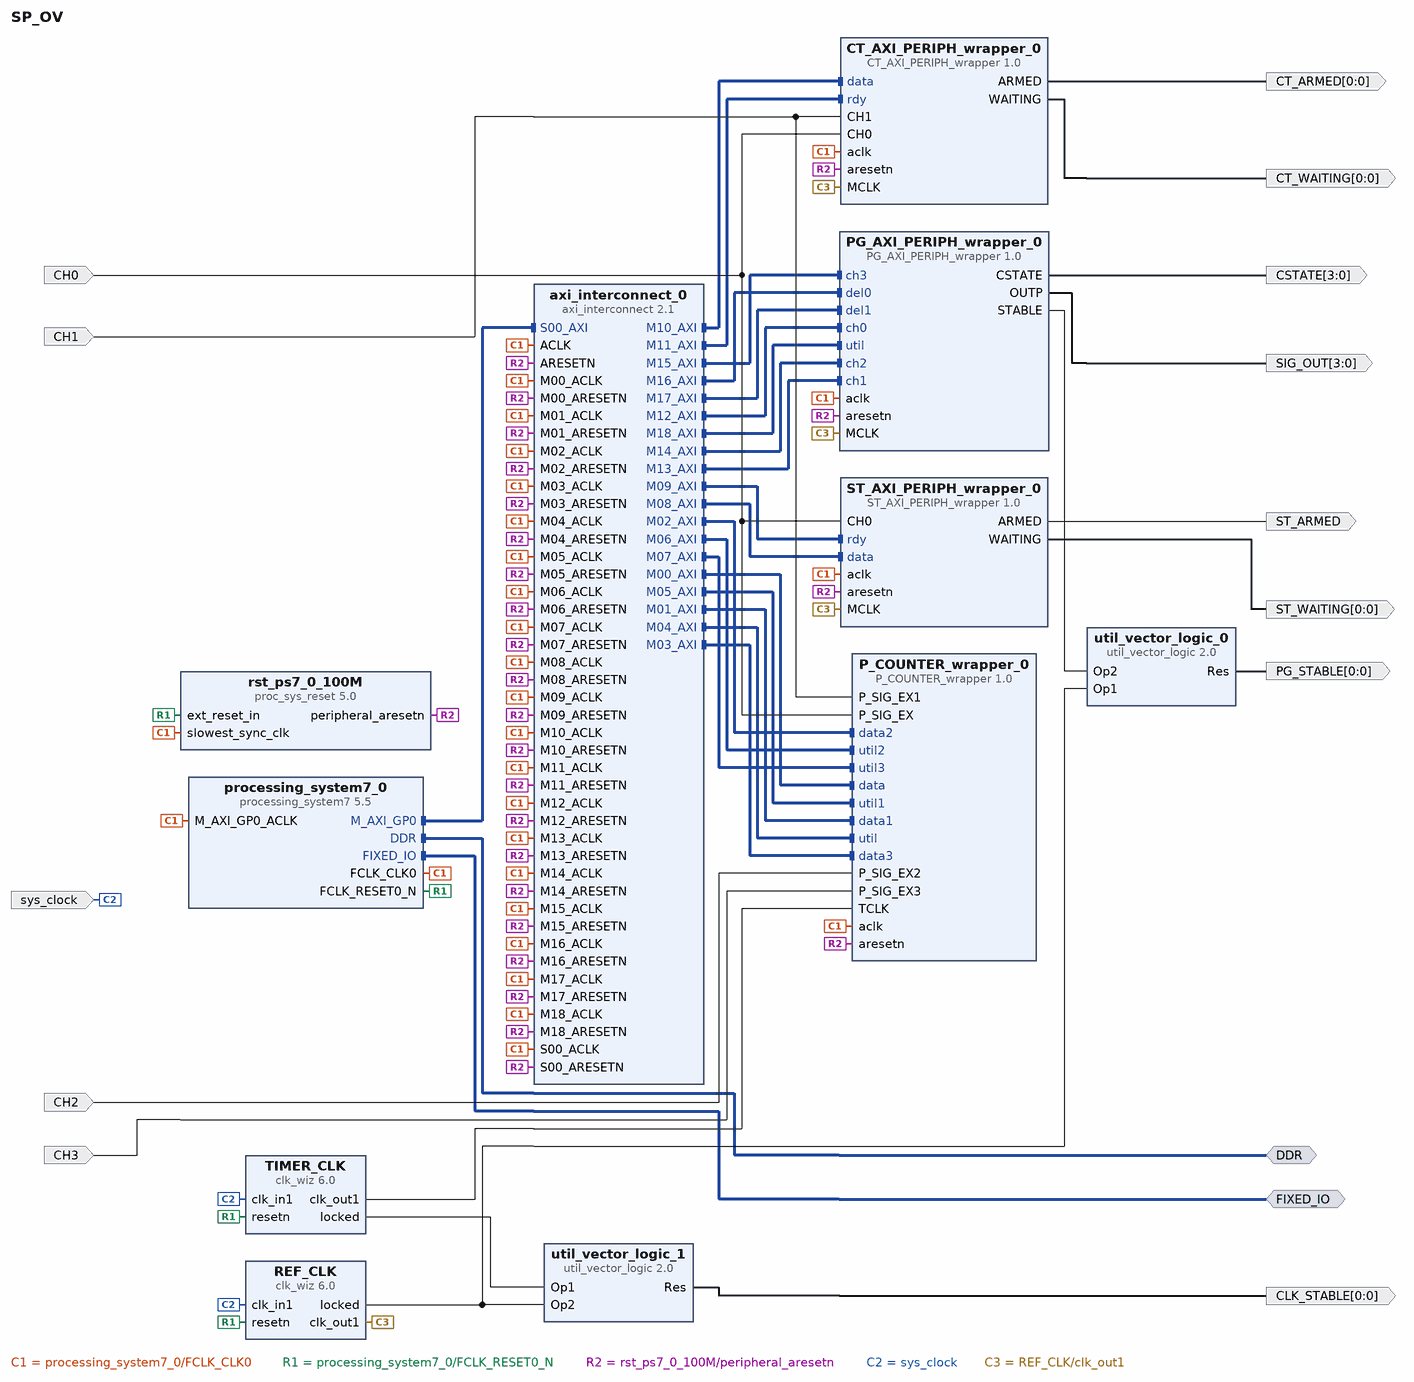
[diagram p0: block diagram of the top level]
# Vivado block design SP_OV, xc7z020clg400-1, Vivado 2019.1
create_bd_design SP_OV

create_bd_intf_port -mode Master -vlnv xilinx.com:interface:ddrx_rtl:1.0 DDR
create_bd_intf_port -mode Master -vlnv xilinx.com:display_processing_system7:fixedio_rtl:1.0 FIXED_IO
create_bd_port -dir I -type clk sys_clock
set_property -dict {CONFIG.FREQ_HZ 125000000 CONFIG.PHASE 0.000} [get_bd_ports sys_clock]
create_bd_port -dir I CH0
create_bd_port -dir I CH1
create_bd_port -dir I CH2
create_bd_port -dir I CH3
create_bd_port -dir O -from 3 -to 0 SIG_OUT
create_bd_port -dir O -from 3 -to 0 CSTATE
create_bd_port -dir O ST_ARMED
create_bd_port -dir O -from 0 -to 0 ST_WAITING
create_bd_port -dir O -from 0 -to 0 CT_ARMED
create_bd_port -dir O -from 0 -to 0 CT_WAITING
create_bd_port -dir O -from 0 -to 0 PG_STABLE
create_bd_port -dir O -from 0 -to 0 CLK_STABLE

create_bd_cell -type ip -vlnv xilinx.com:ip:axi_interconnect:2.1 axi_interconnect_0
set_property -dict {CONFIG.NUM_MI 19} [get_bd_cells axi_interconnect_0]
create_bd_cell -type ip -vlnv xilinx.com:ip:util_vector_logic:2.0 util_vector_logic_0
set_property -dict {CONFIG.C_SIZE 1} [get_bd_cells util_vector_logic_0]
create_bd_cell -type ip -vlnv xilinx.com:ip:util_vector_logic:2.0 util_vector_logic_1
set_property -dict {CONFIG.C_SIZE 1} [get_bd_cells util_vector_logic_1]
create_bd_cell -type ip -vlnv cri.nz:user:CT_AXI_PERIPH_wrapper:1.0 CT_AXI_PERIPH_wrapper_0
create_bd_cell -type ip -vlnv cri.nz:user:P_COUNTER_wrapper:1.0 P_COUNTER_wrapper_0
create_bd_cell -type ip -vlnv cri.nz:user:ST_AXI_PERIPH_wrapper:1.0 ST_AXI_PERIPH_wrapper_0
create_bd_cell -type ip -vlnv xilinx.com:ip:clk_wiz:6.0 REF_CLK
set_property -dict [list \
  CONFIG.CLKIN1_JITTER_PS 80.0 \
  CONFIG.CLKOUT1_JITTER 168.588 \
  CONFIG.CLKOUT1_PHASE_ERROR 234.038 \
  CONFIG.CLKOUT1_REQUESTED_OUT_FREQ 450.000 \
  CONFIG.CLK_IN1_BOARD_INTERFACE sys_clock \
  CONFIG.MMCM_CLKFBOUT_MULT_F 40.500 \
  CONFIG.MMCM_CLKIN1_PERIOD 8.000 \
  CONFIG.MMCM_CLKOUT0_DIVIDE_F 2.250 \
  CONFIG.MMCM_DIVCLK_DIVIDE 5 \
  CONFIG.RESET_PORT resetn \
  CONFIG.RESET_TYPE ACTIVE_LOW \
  CONFIG.USE_BOARD_FLOW true \
] [get_bd_cells REF_CLK]
create_bd_cell -type ip -vlnv xilinx.com:ip:clk_wiz:6.0 TIMER_CLK
set_property -dict [list \
  CONFIG.CLKIN1_JITTER_PS 80.0 \
  CONFIG.CLKOUT1_JITTER 119.348 \
  CONFIG.CLKOUT1_PHASE_ERROR 96.948 \
  CONFIG.CLKOUT1_REQUESTED_OUT_FREQ 125.000 \
  CONFIG.CLK_IN1_BOARD_INTERFACE sys_clock \
  CONFIG.MMCM_CLKFBOUT_MULT_F 8.000 \
  CONFIG.MMCM_CLKIN1_PERIOD 8.000 \
  CONFIG.MMCM_CLKOUT0_DIVIDE_F 8.000 \
  CONFIG.RESET_PORT resetn \
  CONFIG.RESET_TYPE ACTIVE_LOW \
  CONFIG.USE_BOARD_FLOW true \
] [get_bd_cells TIMER_CLK]
create_bd_cell -type ip -vlnv xilinx.com:ip:processing_system7:5.5 processing_system7_0
set_property -dict [list \
  CONFIG.PCW_APU_PERIPHERAL_FREQMHZ 650 \
  CONFIG.PCW_CRYSTAL_PERIPHERAL_FREQMHZ 50 \
  CONFIG.PCW_ENET0_ENET0_IO {MIO 16 .. 27} \
  CONFIG.PCW_ENET0_GRP_MDIO_ENABLE 1 \
  CONFIG.PCW_ENET0_GRP_MDIO_IO {MIO 52 .. 53} \
  CONFIG.PCW_ENET0_PERIPHERAL_ENABLE 1 \
  CONFIG.PCW_ENET0_RESET_ENABLE 1 \
  CONFIG.PCW_ENET0_RESET_IO {MIO 9} \
  CONFIG.PCW_ENET_RESET_ENABLE 1 \
  CONFIG.PCW_ENET_RESET_SELECT {Share reset pin} \
  CONFIG.PCW_FPGA0_PERIPHERAL_FREQMHZ 100 \
  CONFIG.PCW_FPGA1_PERIPHERAL_FREQMHZ 50 \
  CONFIG.PCW_GPIO_MIO_GPIO_ENABLE 1 \
  CONFIG.PCW_GPIO_MIO_GPIO_IO MIO \
  CONFIG.PCW_I2C_RESET_ENABLE 1 \
  CONFIG.PCW_M_AXI_GP0_FREQMHZ 10 \
  CONFIG.PCW_PERIPHERAL_BOARD_PRESET None \
  CONFIG.PCW_PRESET_BANK1_VOLTAGE {LVCMOS 1.8V} \
  CONFIG.PCW_QSPI_GRP_FBCLK_ENABLE 1 \
  CONFIG.PCW_QSPI_GRP_FBCLK_IO {MIO 8} \
  CONFIG.PCW_QSPI_GRP_SINGLE_SS_ENABLE 1 \
  CONFIG.PCW_QSPI_GRP_SINGLE_SS_IO {MIO 1 .. 6} \
  CONFIG.PCW_QSPI_PERIPHERAL_ENABLE 1 \
  CONFIG.PCW_QSPI_QSPI_IO {MIO 1 .. 6} \
  CONFIG.PCW_SD0_GRP_CD_ENABLE 1 \
  CONFIG.PCW_SD0_GRP_CD_IO {MIO 47} \
  CONFIG.PCW_SD0_GRP_WP_ENABLE 0 \
  CONFIG.PCW_SD0_PERIPHERAL_ENABLE 1 \
  CONFIG.PCW_SD0_SD0_IO {MIO 40 .. 45} \
  CONFIG.PCW_SDIO_PERIPHERAL_FREQMHZ 50 \
  CONFIG.PCW_SINGLE_QSPI_DATA_MODE x4 \
  CONFIG.PCW_UART0_PERIPHERAL_ENABLE 1 \
  CONFIG.PCW_UART0_UART0_IO {MIO 14 .. 15} \
  CONFIG.PCW_UART1_PERIPHERAL_ENABLE 0 \
  CONFIG.PCW_UART_PERIPHERAL_FREQMHZ 100 \
  CONFIG.PCW_UIPARAM_DDR_BUS_WIDTH {16 Bit} \
  CONFIG.PCW_UIPARAM_DDR_FREQ_MHZ 525 \
  CONFIG.PCW_UIPARAM_DDR_PARTNO {MT41J256M16 RE-125} \
  CONFIG.PCW_USB0_PERIPHERAL_ENABLE 1 \
  CONFIG.PCW_USB0_RESET_ENABLE 1 \
  CONFIG.PCW_USB0_RESET_IO {MIO 46} \
  CONFIG.PCW_USB0_USB0_IO {MIO 28 .. 39} \
  CONFIG.PCW_USB_RESET_ENABLE 1 \
  CONFIG.PCW_USB_RESET_SELECT {Share reset pin} \
] [get_bd_cells processing_system7_0]
# 497 more settings of processing_system7_0 are not shown: defaults, MIO pin electricals, DDR timing, and values the tool derives
create_bd_cell -type ip -vlnv xilinx.com:ip:proc_sys_reset:5.0 rst_ps7_0_100M
create_bd_cell -type ip -vlnv cri.nz:user:PG_AXI_PERIPH_wrapper:1.0 PG_AXI_PERIPH_wrapper_0

# ---- connections ----

connect_bd_intf_net [get_bd_intf_ports DDR] [get_bd_intf_pins processing_system7_0/DDR]
connect_bd_intf_net [get_bd_intf_pins CT_AXI_PERIPH_wrapper_0/data] [get_bd_intf_pins axi_interconnect_0/M10_AXI]
connect_bd_intf_net [get_bd_intf_pins ST_AXI_PERIPH_wrapper_0/rdy] [get_bd_intf_pins axi_interconnect_0/M09_AXI]
connect_bd_intf_net [get_bd_intf_pins P_COUNTER_wrapper_0/data2] [get_bd_intf_pins axi_interconnect_0/M02_AXI]
connect_bd_intf_net [get_bd_intf_pins axi_interconnect_0/M15_AXI] [get_bd_intf_pins PG_AXI_PERIPH_wrapper_0/ch3]
connect_bd_intf_net [get_bd_intf_ports FIXED_IO] [get_bd_intf_pins processing_system7_0/FIXED_IO]
connect_bd_intf_net [get_bd_intf_pins axi_interconnect_0/M16_AXI] [get_bd_intf_pins PG_AXI_PERIPH_wrapper_0/del0]
connect_bd_intf_net [get_bd_intf_pins P_COUNTER_wrapper_0/util2] [get_bd_intf_pins axi_interconnect_0/M06_AXI]
connect_bd_intf_net [get_bd_intf_pins PG_AXI_PERIPH_wrapper_0/del1] [get_bd_intf_pins axi_interconnect_0/M17_AXI]
connect_bd_intf_net [get_bd_intf_pins ST_AXI_PERIPH_wrapper_0/data] [get_bd_intf_pins axi_interconnect_0/M08_AXI]
connect_bd_intf_net [get_bd_intf_pins P_COUNTER_wrapper_0/util3] [get_bd_intf_pins axi_interconnect_0/M07_AXI]
connect_bd_intf_net [get_bd_intf_pins P_COUNTER_wrapper_0/data] [get_bd_intf_pins axi_interconnect_0/M00_AXI]
connect_bd_intf_net [get_bd_intf_pins axi_interconnect_0/M12_AXI] [get_bd_intf_pins PG_AXI_PERIPH_wrapper_0/ch0]
connect_bd_intf_net [get_bd_intf_pins PG_AXI_PERIPH_wrapper_0/util] [get_bd_intf_pins axi_interconnect_0/M18_AXI]
connect_bd_intf_net [get_bd_intf_pins P_COUNTER_wrapper_0/util1] [get_bd_intf_pins axi_interconnect_0/M05_AXI]
connect_bd_intf_net [get_bd_intf_pins axi_interconnect_0/M14_AXI] [get_bd_intf_pins PG_AXI_PERIPH_wrapper_0/ch2]
connect_bd_intf_net [get_bd_intf_pins processing_system7_0/M_AXI_GP0] [get_bd_intf_pins axi_interconnect_0/S00_AXI]
connect_bd_intf_net [get_bd_intf_pins CT_AXI_PERIPH_wrapper_0/rdy] [get_bd_intf_pins axi_interconnect_0/M11_AXI]
connect_bd_intf_net [get_bd_intf_pins P_COUNTER_wrapper_0/data1] [get_bd_intf_pins axi_interconnect_0/M01_AXI]
connect_bd_intf_net [get_bd_intf_pins axi_interconnect_0/M13_AXI] [get_bd_intf_pins PG_AXI_PERIPH_wrapper_0/ch1]
connect_bd_intf_net [get_bd_intf_pins P_COUNTER_wrapper_0/util] [get_bd_intf_pins axi_interconnect_0/M04_AXI]
connect_bd_intf_net [get_bd_intf_pins P_COUNTER_wrapper_0/data3] [get_bd_intf_pins axi_interconnect_0/M03_AXI]
connect_bd_net [get_bd_pins processing_system7_0/FCLK_CLK0] \
  [get_bd_pins axi_interconnect_0/ACLK] [get_bd_pins axi_interconnect_0/S00_ACLK] [get_bd_pins axi_interconnect_0/M00_ACLK] \
  [get_bd_pins axi_interconnect_0/M01_ACLK] [get_bd_pins axi_interconnect_0/M02_ACLK] \
  [get_bd_pins axi_interconnect_0/M03_ACLK] [get_bd_pins axi_interconnect_0/M04_ACLK] \
  [get_bd_pins axi_interconnect_0/M05_ACLK] [get_bd_pins axi_interconnect_0/M06_ACLK] \
  [get_bd_pins axi_interconnect_0/M07_ACLK] [get_bd_pins axi_interconnect_0/M12_ACLK] \
  [get_bd_pins axi_interconnect_0/M13_ACLK] [get_bd_pins axi_interconnect_0/M14_ACLK] \
  [get_bd_pins axi_interconnect_0/M15_ACLK] [get_bd_pins axi_interconnect_0/M16_ACLK] \
  [get_bd_pins axi_interconnect_0/M17_ACLK] [get_bd_pins axi_interconnect_0/M18_ACLK] \
  [get_bd_pins axi_interconnect_0/M08_ACLK] [get_bd_pins axi_interconnect_0/M09_ACLK] \
  [get_bd_pins axi_interconnect_0/M10_ACLK] [get_bd_pins axi_interconnect_0/M11_ACLK] \
  [get_bd_pins CT_AXI_PERIPH_wrapper_0/aclk] [get_bd_pins P_COUNTER_wrapper_0/aclk] \
  [get_bd_pins ST_AXI_PERIPH_wrapper_0/aclk] [get_bd_pins processing_system7_0/M_AXI_GP0_ACLK] \
  [get_bd_pins rst_ps7_0_100M/slowest_sync_clk] [get_bd_pins PG_AXI_PERIPH_wrapper_0/aclk]
connect_bd_net [get_bd_pins processing_system7_0/FCLK_RESET0_N] \
  [get_bd_pins REF_CLK/resetn] [get_bd_pins TIMER_CLK/resetn] [get_bd_pins rst_ps7_0_100M/ext_reset_in]
connect_bd_net [get_bd_pins rst_ps7_0_100M/peripheral_aresetn] \
  [get_bd_pins axi_interconnect_0/ARESETN] [get_bd_pins axi_interconnect_0/S00_ARESETN] \
  [get_bd_pins axi_interconnect_0/M00_ARESETN] [get_bd_pins axi_interconnect_0/M01_ARESETN] \
  [get_bd_pins axi_interconnect_0/M02_ARESETN] [get_bd_pins axi_interconnect_0/M03_ARESETN] \
  [get_bd_pins axi_interconnect_0/M04_ARESETN] [get_bd_pins axi_interconnect_0/M05_ARESETN] \
  [get_bd_pins axi_interconnect_0/M06_ARESETN] [get_bd_pins axi_interconnect_0/M07_ARESETN] \
  [get_bd_pins axi_interconnect_0/M12_ARESETN] [get_bd_pins axi_interconnect_0/M13_ARESETN] \
  [get_bd_pins axi_interconnect_0/M14_ARESETN] [get_bd_pins axi_interconnect_0/M15_ARESETN] \
  [get_bd_pins axi_interconnect_0/M16_ARESETN] [get_bd_pins axi_interconnect_0/M17_ARESETN] \
  [get_bd_pins axi_interconnect_0/M18_ARESETN] [get_bd_pins axi_interconnect_0/M08_ARESETN] \
  [get_bd_pins axi_interconnect_0/M09_ARESETN] [get_bd_pins axi_interconnect_0/M10_ARESETN] \
  [get_bd_pins axi_interconnect_0/M11_ARESETN] [get_bd_pins CT_AXI_PERIPH_wrapper_0/aresetn] \
  [get_bd_pins P_COUNTER_wrapper_0/aresetn] [get_bd_pins ST_AXI_PERIPH_wrapper_0/aresetn] \
  [get_bd_pins PG_AXI_PERIPH_wrapper_0/aresetn]
connect_bd_net [get_bd_ports sys_clock] [get_bd_pins REF_CLK/clk_in1] [get_bd_pins TIMER_CLK/clk_in1]
connect_bd_net [get_bd_pins REF_CLK/clk_out1] \
  [get_bd_pins CT_AXI_PERIPH_wrapper_0/MCLK] [get_bd_pins ST_AXI_PERIPH_wrapper_0/MCLK] \
  [get_bd_pins PG_AXI_PERIPH_wrapper_0/MCLK]
connect_bd_net [get_bd_ports CH0] \
  [get_bd_pins CT_AXI_PERIPH_wrapper_0/CH0] [get_bd_pins P_COUNTER_wrapper_0/P_SIG_EX] \
  [get_bd_pins ST_AXI_PERIPH_wrapper_0/CH0]
connect_bd_net -net CH1_1 [get_bd_ports CH1] [get_bd_pins CT_AXI_PERIPH_wrapper_0/CH1] [get_bd_pins P_COUNTER_wrapper_0/P_SIG_EX1]
connect_bd_net [get_bd_pins PG_AXI_PERIPH_wrapper_0/OUTP] [get_bd_ports SIG_OUT]
connect_bd_net [get_bd_pins PG_AXI_PERIPH_wrapper_0/CSTATE] [get_bd_ports CSTATE]
connect_bd_net [get_bd_pins PG_AXI_PERIPH_wrapper_0/STABLE] [get_bd_pins util_vector_logic_0/Op2]
connect_bd_net [get_bd_pins REF_CLK/locked] [get_bd_pins util_vector_logic_0/Op1] [get_bd_pins util_vector_logic_1/Op2]
connect_bd_net [get_bd_pins util_vector_logic_0/Res] [get_bd_ports PG_STABLE]
connect_bd_net [get_bd_pins util_vector_logic_1/Res] [get_bd_ports CLK_STABLE]
connect_bd_net [get_bd_pins TIMER_CLK/locked] [get_bd_pins util_vector_logic_1/Op1]
connect_bd_net [get_bd_pins ST_AXI_PERIPH_wrapper_0/ARMED] [get_bd_ports ST_ARMED]
connect_bd_net [get_bd_pins ST_AXI_PERIPH_wrapper_0/WAITING] [get_bd_ports ST_WAITING]
connect_bd_net -net CH2_1 [get_bd_ports CH2] [get_bd_pins P_COUNTER_wrapper_0/P_SIG_EX2]
connect_bd_net -net CH3_1 [get_bd_ports CH3] [get_bd_pins P_COUNTER_wrapper_0/P_SIG_EX3]
connect_bd_net [get_bd_pins TIMER_CLK/clk_out1] [get_bd_pins P_COUNTER_wrapper_0/TCLK]
connect_bd_net [get_bd_pins CT_AXI_PERIPH_wrapper_0/WAITING] [get_bd_ports CT_WAITING]
connect_bd_net [get_bd_pins CT_AXI_PERIPH_wrapper_0/ARMED] [get_bd_ports CT_ARMED]

# ---- address map ----
assign_bd_address -offset 0x43C00000 -range 64K -target_address_space [get_bd_addr_spaces processing_system7_0/Data] [get_bd_addr_segs P_COUNTER_wrapper_0/data/reg0]
assign_bd_address -offset 0x43C10000 -range 64K -target_address_space [get_bd_addr_spaces processing_system7_0/Data] [get_bd_addr_segs P_COUNTER_wrapper_0/data1/reg0]
assign_bd_address -offset 0x43C20000 -range 64K -target_address_space [get_bd_addr_spaces processing_system7_0/Data] [get_bd_addr_segs P_COUNTER_wrapper_0/data2/reg0]
assign_bd_address -offset 0x43C30000 -range 64K -target_address_space [get_bd_addr_spaces processing_system7_0/Data] [get_bd_addr_segs P_COUNTER_wrapper_0/data3/reg0]
assign_bd_address -offset 0x43C40000 -range 64K -target_address_space [get_bd_addr_spaces processing_system7_0/Data] [get_bd_addr_segs P_COUNTER_wrapper_0/util/reg0]
assign_bd_address -offset 0x43C50000 -range 64K -target_address_space [get_bd_addr_spaces processing_system7_0/Data] [get_bd_addr_segs P_COUNTER_wrapper_0/util1/reg0]
assign_bd_address -offset 0x43C60000 -range 64K -target_address_space [get_bd_addr_spaces processing_system7_0/Data] [get_bd_addr_segs P_COUNTER_wrapper_0/util2/reg0]
assign_bd_address -offset 0x43C70000 -range 64K -target_address_space [get_bd_addr_spaces processing_system7_0/Data] [get_bd_addr_segs P_COUNTER_wrapper_0/util3/reg0]
assign_bd_address -offset 0x43C80000 -range 64K -target_address_space [get_bd_addr_spaces processing_system7_0/Data] [get_bd_addr_segs ST_AXI_PERIPH_wrapper_0/data/reg0]
assign_bd_address -offset 0x43C90000 -range 64K -target_address_space [get_bd_addr_spaces processing_system7_0/Data] [get_bd_addr_segs ST_AXI_PERIPH_wrapper_0/rdy/reg0]
assign_bd_address -offset 0x43CA0000 -range 64K -target_address_space [get_bd_addr_spaces processing_system7_0/Data] [get_bd_addr_segs CT_AXI_PERIPH_wrapper_0/data/reg0]
assign_bd_address -offset 0x43CB0000 -range 64K -target_address_space [get_bd_addr_spaces processing_system7_0/Data] [get_bd_addr_segs CT_AXI_PERIPH_wrapper_0/rdy/reg0]
assign_bd_address -offset 0x43CC0000 -range 64K -target_address_space [get_bd_addr_spaces processing_system7_0/Data] [get_bd_addr_segs PG_AXI_PERIPH_wrapper_0/ch0/reg0]
assign_bd_address -offset 0x43CD0000 -range 64K -target_address_space [get_bd_addr_spaces processing_system7_0/Data] [get_bd_addr_segs PG_AXI_PERIPH_wrapper_0/ch1/reg0]
assign_bd_address -offset 0x43CE0000 -range 64K -target_address_space [get_bd_addr_spaces processing_system7_0/Data] [get_bd_addr_segs PG_AXI_PERIPH_wrapper_0/ch2/reg0]
assign_bd_address -offset 0x43CF0000 -range 64K -target_address_space [get_bd_addr_spaces processing_system7_0/Data] [get_bd_addr_segs PG_AXI_PERIPH_wrapper_0/ch3/reg0]
assign_bd_address -offset 0x43D00000 -range 64K -target_address_space [get_bd_addr_spaces processing_system7_0/Data] [get_bd_addr_segs PG_AXI_PERIPH_wrapper_0/del0/reg0]
assign_bd_address -offset 0x43D10000 -range 64K -target_address_space [get_bd_addr_spaces processing_system7_0/Data] [get_bd_addr_segs PG_AXI_PERIPH_wrapper_0/del1/reg0]
assign_bd_address -offset 0x43D20000 -range 64K -target_address_space [get_bd_addr_spaces processing_system7_0/Data] [get_bd_addr_segs PG_AXI_PERIPH_wrapper_0/util/reg0]

validate_bd_design
save_bd_design
